# Altium schematic sheet 0012_Processor - PEG, D.SchDoc
size A3
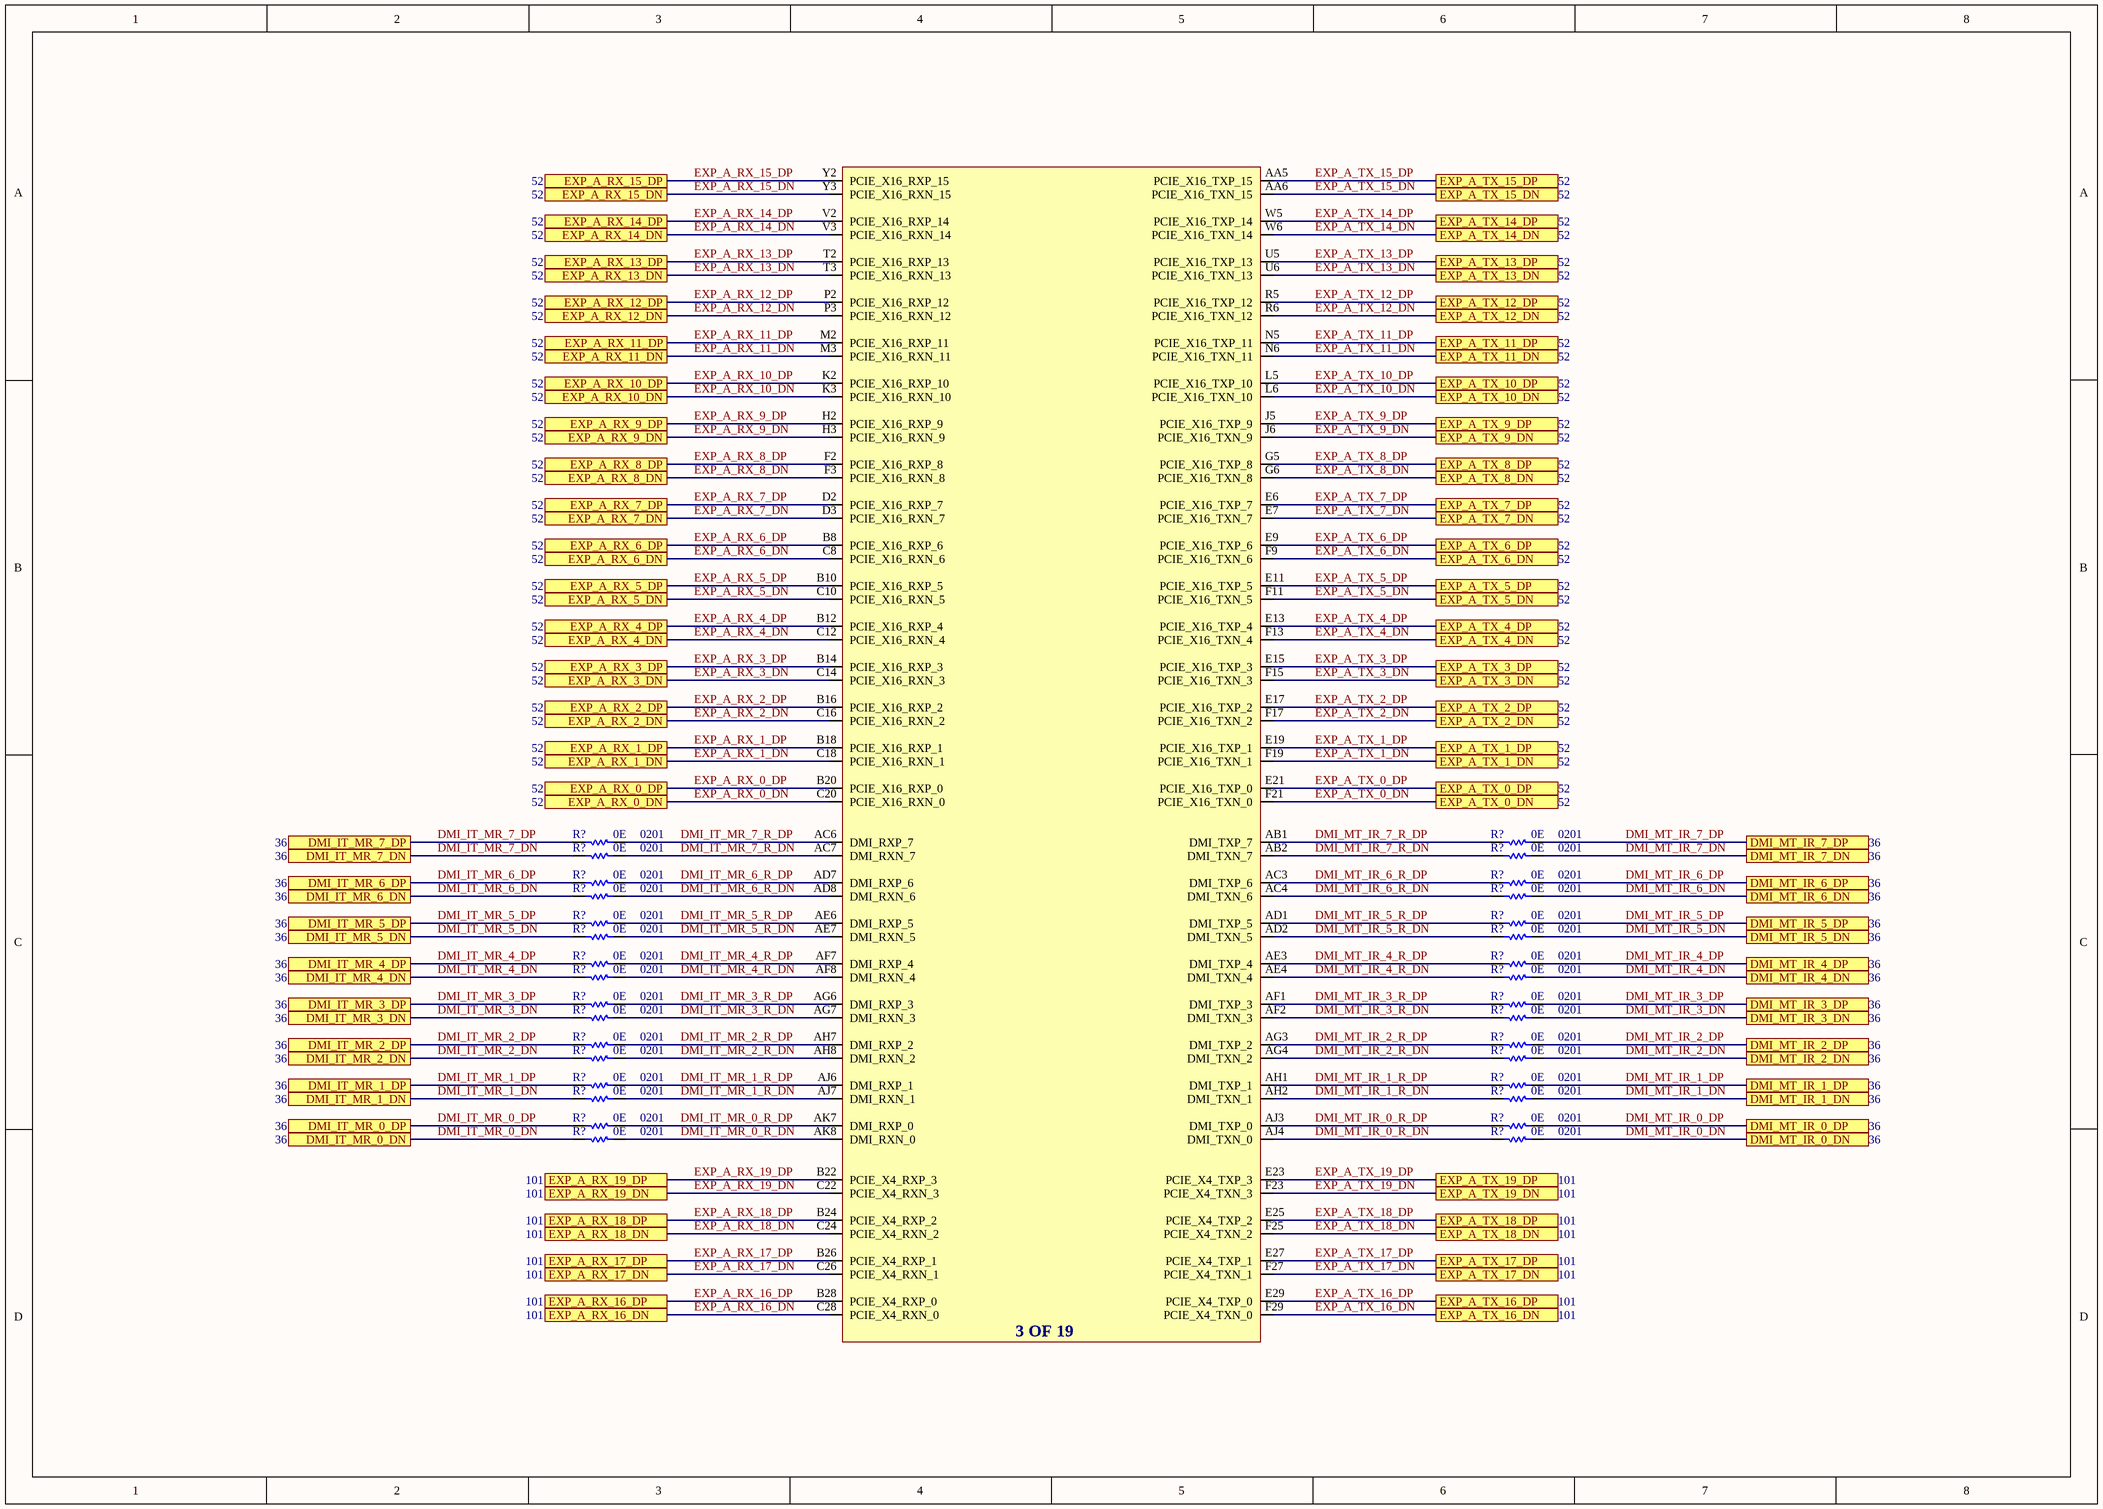
[diagram p0: 0012_Processor - PEG, D.SchDoc]

## Parts
(Parts that share a designator on the sheet are numbered #1, #2 ... from top to bottom, then left to right.)
R?#1  value 0E  Case/Package: 0201  [RESC0201]  (hidden comment: Res)
R?#2  value 0E  Case/Package: 0201  [RESC0201]  (hidden comment: Res)
R?#3  value 0E  Case/Package: 0201  [RESC0201]  (hidden comment: Res)
R?#4  value 0E  Case/Package: 0201  [RESC0201]  (hidden comment: Res)
R?#5  value 0E  Case/Package: 0201  [RESC0201]  (hidden comment: Res)
R?#6  value 0E  Case/Package: 0201  [RESC0201]  (hidden comment: Res)
R?#7  value 0E  Case/Package: 0201  [RESC0201]  (hidden comment: Res)
R?#8  value 0E  Case/Package: 0201  [RESC0201]  (hidden comment: Res)
R?#9  value 0E  Case/Package: 0201  [RESC0201]  (hidden comment: Res)
R?#10  value 0E  Case/Package: 0201  [RESC0201]  (hidden comment: Res)
R?#11  value 0E  Case/Package: 0201  [RESC0201]  (hidden comment: Res)
R?#12  value 0E  Case/Package: 0201  [RESC0201]  (hidden comment: Res)
R?#13  value 0E  Case/Package: 0201  [RESC0201]  (hidden comment: Res)
R?#14  value 0E  Case/Package: 0201  [RESC0201]  (hidden comment: Res)
R?#15  value 0E  Case/Package: 0201  [RESC0201]  (hidden comment: Res)
R?#16  value 0E  Case/Package: 0201  [RESC0201]  (hidden comment: Res)
R?#17  value 0E  Case/Package: 0201  [RESC0201]  (hidden comment: Res)
R?#18  value 0E  Case/Package: 0201  [RESC0201]  (hidden comment: Res)
R?#19  value 0E  Case/Package: 0201  [RESC0201]  (hidden comment: Res)
R?#20  value 0E  Case/Package: 0201  [RESC0201]  (hidden comment: Res)
R?#21  value 0E  Case/Package: 0201  [RESC0201]  (hidden comment: Res)
R?#22  value 0E  Case/Package: 0201  [RESC0201]  (hidden comment: Res)
R?#23  value 0E  Case/Package: 0201  [RESC0201]  (hidden comment: Res)
R?#24  value 0E  Case/Package: 0201  [RESC0201]  (hidden comment: Res)
R?#25  value 0E  Case/Package: 0201  [RESC0201]  (hidden comment: Res)
R?#26  value 0E  Case/Package: 0201  [RESC0201]  (hidden comment: Res)
R?#27  value 0E  Case/Package: 0201  [RESC0201]  (hidden comment: Res)
R?#28  value 0E  Case/Package: 0201  [RESC0201]  (hidden comment: Res)
R?#29  value 0E  Case/Package: 0201  [RESC0201]  (hidden comment: Res)
R?#30  value 0E  Case/Package: 0201  [RESC0201]  (hidden comment: Res)
R?#31  value 0E  Case/Package: 0201  [RESC0201]  (hidden comment: Res)
R?#32  value 0E  Case/Package: 0201  [RESC0201]  (hidden comment: Res)
U1401  C_RPL_HX_EXT  (value not drawn)  (part C of 19)

## Ports
DMI_IT_MR_0_DN, DMI_IT_MR_0_DP, DMI_IT_MR_1_DN, DMI_IT_MR_1_DP, DMI_IT_MR_2_DN, DMI_IT_MR_2_DP, DMI_IT_MR_3_DN, DMI_IT_MR_3_DP, DMI_IT_MR_4_DN, DMI_IT_MR_4_DP, DMI_IT_MR_5_DN, DMI_IT_MR_5_DP, DMI_IT_MR_6_DN, DMI_IT_MR_6_DP, DMI_IT_MR_7_DN, DMI_IT_MR_7_DP, DMI_MT_IR_0_DN, DMI_MT_IR_0_DP, DMI_MT_IR_1_DN, DMI_MT_IR_1_DP, DMI_MT_IR_2_DN, DMI_MT_IR_2_DP, DMI_MT_IR_3_DN, DMI_MT_IR_3_DP, DMI_MT_IR_4_DN, DMI_MT_IR_4_DP, DMI_MT_IR_5_DN, DMI_MT_IR_5_DP, DMI_MT_IR_6_DN, DMI_MT_IR_6_DP, DMI_MT_IR_7_DN, DMI_MT_IR_7_DP, EXP_A_RX_0_DN, EXP_A_RX_0_DP, EXP_A_RX_1_DN, EXP_A_RX_1_DP, EXP_A_RX_2_DN, EXP_A_RX_2_DP, EXP_A_RX_3_DN, EXP_A_RX_3_DP, EXP_A_RX_4_DN, EXP_A_RX_4_DP, EXP_A_RX_5_DN, EXP_A_RX_5_DP, EXP_A_RX_6_DN, EXP_A_RX_6_DP, EXP_A_RX_7_DN, EXP_A_RX_7_DP, EXP_A_RX_8_DN, EXP_A_RX_8_DP, EXP_A_RX_9_DN, EXP_A_RX_9_DP, EXP_A_RX_10_DN, EXP_A_RX_10_DP, EXP_A_RX_11_DN, EXP_A_RX_11_DP, EXP_A_RX_12_DN, EXP_A_RX_12_DP, EXP_A_RX_13_DN, EXP_A_RX_13_DP, EXP_A_RX_14_DN, EXP_A_RX_14_DP, EXP_A_RX_15_DN, EXP_A_RX_15_DP, EXP_A_RX_16_DN, EXP_A_RX_16_DP, EXP_A_RX_17_DN, EXP_A_RX_17_DP, EXP_A_RX_18_DN, EXP_A_RX_18_DP, EXP_A_RX_19_DN, EXP_A_RX_19_DP, EXP_A_TX_0_DN, EXP_A_TX_0_DP, EXP_A_TX_1_DN, EXP_A_TX_1_DP, EXP_A_TX_2_DN, EXP_A_TX_2_DP, EXP_A_TX_3_DN, EXP_A_TX_3_DP, EXP_A_TX_4_DN, EXP_A_TX_4_DP, EXP_A_TX_5_DN, EXP_A_TX_5_DP, EXP_A_TX_6_DN, EXP_A_TX_6_DP, EXP_A_TX_7_DN, EXP_A_TX_7_DP, EXP_A_TX_8_DN, EXP_A_TX_8_DP, EXP_A_TX_9_DN, EXP_A_TX_9_DP, EXP_A_TX_10_DN, EXP_A_TX_10_DP, EXP_A_TX_11_DN, EXP_A_TX_11_DP, EXP_A_TX_12_DN, EXP_A_TX_12_DP, EXP_A_TX_13_DN, EXP_A_TX_13_DP, EXP_A_TX_14_DN, EXP_A_TX_14_DP, EXP_A_TX_15_DN, EXP_A_TX_15_DP, EXP_A_TX_16_DN, EXP_A_TX_16_DP, EXP_A_TX_17_DN, EXP_A_TX_17_DP, EXP_A_TX_18_DN, EXP_A_TX_18_DP, EXP_A_TX_19_DN, EXP_A_TX_19_DP

## Nets
DMI_IT_MR_0_DN: R?#31.1 ; port DMI_IT_MR_0_DN
DMI_IT_MR_0_DP: R?#29.1 ; port DMI_IT_MR_0_DP
DMI_IT_MR_0_R_DN: R?#31.2 U1401.AK8(DMI_RXN_0)
DMI_IT_MR_0_R_DP: R?#29.2 U1401.AK7(DMI_RXP_0)
DMI_IT_MR_1_DN: R?#27.1 ; port DMI_IT_MR_1_DN
DMI_IT_MR_1_DP: R?#25.1 ; port DMI_IT_MR_1_DP
DMI_IT_MR_1_R_DN: R?#27.2 U1401.AJ7(DMI_RXN_1)
DMI_IT_MR_1_R_DP: R?#25.2 U1401.AJ6(DMI_RXP_1)
DMI_IT_MR_2_DN: R?#23.1 ; port DMI_IT_MR_2_DN
DMI_IT_MR_2_DP: R?#21.1 ; port DMI_IT_MR_2_DP
DMI_IT_MR_2_R_DN: R?#23.2 U1401.AH8(DMI_RXN_2)
DMI_IT_MR_2_R_DP: R?#21.2 U1401.AH7(DMI_RXP_2)
DMI_IT_MR_3_DN: R?#19.1 ; port DMI_IT_MR_3_DN
DMI_IT_MR_3_DP: R?#17.1 ; port DMI_IT_MR_3_DP
DMI_IT_MR_3_R_DN: R?#19.2 U1401.AG7(DMI_RXN_3)
DMI_IT_MR_3_R_DP: R?#17.2 U1401.AG6(DMI_RXP_3)
DMI_IT_MR_4_DN: R?#15.1 ; port DMI_IT_MR_4_DN
DMI_IT_MR_4_DP: R?#13.1 ; port DMI_IT_MR_4_DP
DMI_IT_MR_4_R_DN: R?#15.2 U1401.AF8(DMI_RXN_4)
DMI_IT_MR_4_R_DP: R?#13.2 U1401.AF7(DMI_RXP_4)
DMI_IT_MR_5_DN: R?#11.1 ; port DMI_IT_MR_5_DN
DMI_IT_MR_5_DP: R?#9.1 ; port DMI_IT_MR_5_DP
DMI_IT_MR_5_R_DN: R?#11.2 U1401.AE7(DMI_RXN_5)
DMI_IT_MR_5_R_DP: R?#9.2 U1401.AE6(DMI_RXP_5)
DMI_IT_MR_6_DN: R?#7.1 ; port DMI_IT_MR_6_DN
DMI_IT_MR_6_DP: R?#5.1 ; port DMI_IT_MR_6_DP
DMI_IT_MR_6_R_DN: R?#7.2 U1401.AD8(DMI_RXN_6)
DMI_IT_MR_6_R_DP: R?#5.2 U1401.AD7(DMI_RXP_6)
DMI_IT_MR_7_DN: R?#3.1 ; port DMI_IT_MR_7_DN
DMI_IT_MR_7_DP: R?#1.1 ; port DMI_IT_MR_7_DP
DMI_IT_MR_7_R_DN: R?#3.2 U1401.AC7(DMI_RXN_7)
DMI_IT_MR_7_R_DP: R?#1.2 U1401.AC6(DMI_RXP_7)
DMI_MT_IR_0_DN: R?#32.2 ; port DMI_MT_IR_0_DN
DMI_MT_IR_0_DP: R?#30.2 ; port DMI_MT_IR_0_DP
DMI_MT_IR_0_R_DN: R?#32.1 U1401.AJ4(DMI_TXN_0)
DMI_MT_IR_0_R_DP: R?#30.1 U1401.AJ3(DMI_TXP_0)
DMI_MT_IR_1_DN: R?#28.2 ; port DMI_MT_IR_1_DN
DMI_MT_IR_1_DP: R?#26.2 ; port DMI_MT_IR_1_DP
DMI_MT_IR_1_R_DN: R?#28.1 U1401.AH2(DMI_TXN_1)
DMI_MT_IR_1_R_DP: R?#26.1 U1401.AH1(DMI_TXP_1)
DMI_MT_IR_2_DN: R?#24.2 ; port DMI_MT_IR_2_DN
DMI_MT_IR_2_DP: R?#22.2 ; port DMI_MT_IR_2_DP
DMI_MT_IR_2_R_DN: R?#24.1 U1401.AG4(DMI_TXN_2)
DMI_MT_IR_2_R_DP: R?#22.1 U1401.AG3(DMI_TXP_2)
DMI_MT_IR_3_DN: R?#20.2 ; port DMI_MT_IR_3_DN
DMI_MT_IR_3_DP: R?#18.2 ; port DMI_MT_IR_3_DP
DMI_MT_IR_3_R_DN: R?#20.1 U1401.AF2(DMI_TXN_3)
DMI_MT_IR_3_R_DP: R?#18.1 U1401.AF1(DMI_TXP_3)
DMI_MT_IR_4_DN: R?#16.2 ; port DMI_MT_IR_4_DN
DMI_MT_IR_4_DP: R?#14.2 ; port DMI_MT_IR_4_DP
DMI_MT_IR_4_R_DN: R?#16.1 U1401.AE4(DMI_TXN_4)
DMI_MT_IR_4_R_DP: R?#14.1 U1401.AE3(DMI_TXP_4)
DMI_MT_IR_5_DN: R?#12.2 ; port DMI_MT_IR_5_DN
DMI_MT_IR_5_DP: R?#10.2 ; port DMI_MT_IR_5_DP
DMI_MT_IR_5_R_DN: R?#12.1 U1401.AD2(DMI_TXN_5)
DMI_MT_IR_5_R_DP: R?#10.1 U1401.AD1(DMI_TXP_5)
DMI_MT_IR_6_DN: R?#8.2 ; port DMI_MT_IR_6_DN
DMI_MT_IR_6_DP: R?#6.2 ; port DMI_MT_IR_6_DP
DMI_MT_IR_6_R_DN: R?#8.1 U1401.AC4(DMI_TXN_6)
DMI_MT_IR_6_R_DP: R?#6.1 U1401.AC3(DMI_TXP_6)
DMI_MT_IR_7_DN: R?#4.2 ; port DMI_MT_IR_7_DN
DMI_MT_IR_7_DP: R?#2.2 ; port DMI_MT_IR_7_DP
DMI_MT_IR_7_R_DN: R?#4.1 U1401.AB2(DMI_TXN_7)
DMI_MT_IR_7_R_DP: R?#2.1 U1401.AB1(DMI_TXP_7)
EXP_A_RX_0_DN: U1401.C20(PCIE_X16_RXN_0) ; port EXP_A_RX_0_DN
EXP_A_RX_0_DP: U1401.B20(PCIE_X16_RXP_0) ; port EXP_A_RX_0_DP
EXP_A_RX_1_DN: U1401.C18(PCIE_X16_RXN_1) ; port EXP_A_RX_1_DN
EXP_A_RX_1_DP: U1401.B18(PCIE_X16_RXP_1) ; port EXP_A_RX_1_DP
EXP_A_RX_2_DN: U1401.C16(PCIE_X16_RXN_2) ; port EXP_A_RX_2_DN
EXP_A_RX_2_DP: U1401.B16(PCIE_X16_RXP_2) ; port EXP_A_RX_2_DP
EXP_A_RX_3_DN: U1401.C14(PCIE_X16_RXN_3) ; port EXP_A_RX_3_DN
EXP_A_RX_3_DP: U1401.B14(PCIE_X16_RXP_3) ; port EXP_A_RX_3_DP
EXP_A_RX_4_DN: U1401.C12(PCIE_X16_RXN_4) ; port EXP_A_RX_4_DN
EXP_A_RX_4_DP: U1401.B12(PCIE_X16_RXP_4) ; port EXP_A_RX_4_DP
EXP_A_RX_5_DN: U1401.C10(PCIE_X16_RXN_5) ; port EXP_A_RX_5_DN
EXP_A_RX_5_DP: U1401.B10(PCIE_X16_RXP_5) ; port EXP_A_RX_5_DP
EXP_A_RX_6_DN: U1401.C8(PCIE_X16_RXN_6) ; port EXP_A_RX_6_DN
EXP_A_RX_6_DP: U1401.B8(PCIE_X16_RXP_6) ; port EXP_A_RX_6_DP
EXP_A_RX_7_DN: U1401.D3(PCIE_X16_RXN_7) ; port EXP_A_RX_7_DN
EXP_A_RX_7_DP: U1401.D2(PCIE_X16_RXP_7) ; port EXP_A_RX_7_DP
EXP_A_RX_8_DN: U1401.F3(PCIE_X16_RXN_8) ; port EXP_A_RX_8_DN
EXP_A_RX_8_DP: U1401.F2(PCIE_X16_RXP_8) ; port EXP_A_RX_8_DP
EXP_A_RX_9_DN: U1401.H3(PCIE_X16_RXN_9) ; port EXP_A_RX_9_DN
EXP_A_RX_9_DP: U1401.H2(PCIE_X16_RXP_9) ; port EXP_A_RX_9_DP
EXP_A_RX_10_DN: U1401.K3(PCIE_X16_RXN_10) ; port EXP_A_RX_10_DN
EXP_A_RX_10_DP: U1401.K2(PCIE_X16_RXP_10) ; port EXP_A_RX_10_DP
EXP_A_RX_11_DN: U1401.M3(PCIE_X16_RXN_11) ; port EXP_A_RX_11_DN
EXP_A_RX_11_DP: U1401.M2(PCIE_X16_RXP_11) ; port EXP_A_RX_11_DP
EXP_A_RX_12_DN: U1401.P3(PCIE_X16_RXN_12) ; port EXP_A_RX_12_DN
EXP_A_RX_12_DP: U1401.P2(PCIE_X16_RXP_12) ; port EXP_A_RX_12_DP
EXP_A_RX_13_DN: U1401.T3(PCIE_X16_RXN_13) ; port EXP_A_RX_13_DN
EXP_A_RX_13_DP: U1401.T2(PCIE_X16_RXP_13) ; port EXP_A_RX_13_DP
EXP_A_RX_14_DN: U1401.V3(PCIE_X16_RXN_14) ; port EXP_A_RX_14_DN
EXP_A_RX_14_DP: U1401.V2(PCIE_X16_RXP_14) ; port EXP_A_RX_14_DP
EXP_A_RX_15_DN: U1401.Y3(PCIE_X16_RXN_15) ; port EXP_A_RX_15_DN
EXP_A_RX_15_DP: U1401.Y2(PCIE_X16_RXP_15) ; port EXP_A_RX_15_DP
EXP_A_RX_16_DN: U1401.C28(PCIE_X4_RXN_0) ; port EXP_A_RX_16_DN
EXP_A_RX_16_DP: U1401.B28(PCIE_X4_RXP_0) ; port EXP_A_RX_16_DP
EXP_A_RX_17_DN: U1401.C26(PCIE_X4_RXN_1) ; port EXP_A_RX_17_DN
EXP_A_RX_17_DP: U1401.B26(PCIE_X4_RXP_1) ; port EXP_A_RX_17_DP
EXP_A_RX_18_DN: U1401.C24(PCIE_X4_RXN_2) ; port EXP_A_RX_18_DN
EXP_A_RX_18_DP: U1401.B24(PCIE_X4_RXP_2) ; port EXP_A_RX_18_DP
EXP_A_RX_19_DN: U1401.C22(PCIE_X4_RXN_3) ; port EXP_A_RX_19_DN
EXP_A_RX_19_DP: U1401.B22(PCIE_X4_RXP_3) ; port EXP_A_RX_19_DP
EXP_A_TX_0_DN: U1401.F21(PCIE_X16_TXN_0) ; port EXP_A_TX_0_DN
EXP_A_TX_0_DP: U1401.E21(PCIE_X16_TXP_0) ; port EXP_A_TX_0_DP
EXP_A_TX_1_DN: U1401.F19(PCIE_X16_TXN_1) ; port EXP_A_TX_1_DN
EXP_A_TX_1_DP: U1401.E19(PCIE_X16_TXP_1) ; port EXP_A_TX_1_DP
EXP_A_TX_2_DN: U1401.F17(PCIE_X16_TXN_2) ; port EXP_A_TX_2_DN
EXP_A_TX_2_DP: U1401.E17(PCIE_X16_TXP_2) ; port EXP_A_TX_2_DP
EXP_A_TX_3_DN: U1401.F15(PCIE_X16_TXN_3) ; port EXP_A_TX_3_DN
EXP_A_TX_3_DP: U1401.E15(PCIE_X16_TXP_3) ; port EXP_A_TX_3_DP
EXP_A_TX_4_DN: U1401.F13(PCIE_X16_TXN_4) ; port EXP_A_TX_4_DN
EXP_A_TX_4_DP: U1401.E13(PCIE_X16_TXP_4) ; port EXP_A_TX_4_DP
EXP_A_TX_5_DN: U1401.F11(PCIE_X16_TXN_5) ; port EXP_A_TX_5_DN
EXP_A_TX_5_DP: U1401.E11(PCIE_X16_TXP_5) ; port EXP_A_TX_5_DP
EXP_A_TX_6_DN: U1401.F9(PCIE_X16_TXN_6) ; port EXP_A_TX_6_DN
EXP_A_TX_6_DP: U1401.E9(PCIE_X16_TXP_6) ; port EXP_A_TX_6_DP
EXP_A_TX_7_DN: U1401.E7(PCIE_X16_TXN_7) ; port EXP_A_TX_7_DN
EXP_A_TX_7_DP: U1401.E6(PCIE_X16_TXP_7) ; port EXP_A_TX_7_DP
EXP_A_TX_8_DN: U1401.G6(PCIE_X16_TXN_8) ; port EXP_A_TX_8_DN
EXP_A_TX_8_DP: U1401.G5(PCIE_X16_TXP_8) ; port EXP_A_TX_8_DP
EXP_A_TX_9_DN: U1401.J6(PCIE_X16_TXN_9) ; port EXP_A_TX_9_DN
EXP_A_TX_9_DP: U1401.J5(PCIE_X16_TXP_9) ; port EXP_A_TX_9_DP
EXP_A_TX_10_DN: U1401.L6(PCIE_X16_TXN_10) ; port EXP_A_TX_10_DN
EXP_A_TX_10_DP: U1401.L5(PCIE_X16_TXP_10) ; port EXP_A_TX_10_DP
EXP_A_TX_11_DN: U1401.N6(PCIE_X16_TXN_11) ; port EXP_A_TX_11_DN
EXP_A_TX_11_DP: U1401.N5(PCIE_X16_TXP_11) ; port EXP_A_TX_11_DP
EXP_A_TX_12_DN: U1401.R6(PCIE_X16_TXN_12) ; port EXP_A_TX_12_DN
EXP_A_TX_12_DP: U1401.R5(PCIE_X16_TXP_12) ; port EXP_A_TX_12_DP
EXP_A_TX_13_DN: U1401.U6(PCIE_X16_TXN_13) ; port EXP_A_TX_13_DN
EXP_A_TX_13_DP: U1401.U5(PCIE_X16_TXP_13) ; port EXP_A_TX_13_DP
EXP_A_TX_14_DN: U1401.W6(PCIE_X16_TXN_14) ; port EXP_A_TX_14_DN
EXP_A_TX_14_DP: U1401.W5(PCIE_X16_TXP_14) ; port EXP_A_TX_14_DP
EXP_A_TX_15_DN: U1401.AA6(PCIE_X16_TXN_15) ; port EXP_A_TX_15_DN
EXP_A_TX_15_DP: U1401.AA5(PCIE_X16_TXP_15) ; port EXP_A_TX_15_DP
EXP_A_TX_16_DN: U1401.F29(PCIE_X4_TXN_0) ; port EXP_A_TX_16_DN
EXP_A_TX_16_DP: U1401.E29(PCIE_X4_TXP_0) ; port EXP_A_TX_16_DP
EXP_A_TX_17_DN: U1401.F27(PCIE_X4_TXN_1) ; port EXP_A_TX_17_DN
EXP_A_TX_17_DP: U1401.E27(PCIE_X4_TXP_1) ; port EXP_A_TX_17_DP
EXP_A_TX_18_DN: U1401.F25(PCIE_X4_TXN_2) ; port EXP_A_TX_18_DN
EXP_A_TX_18_DP: U1401.E25(PCIE_X4_TXP_2) ; port EXP_A_TX_18_DP
EXP_A_TX_19_DN: U1401.F23(PCIE_X4_TXN_3) ; port EXP_A_TX_19_DN
EXP_A_TX_19_DP: U1401.E23(PCIE_X4_TXP_3) ; port EXP_A_TX_19_DP

## Notes on the sheet
- (in symbol C_RPL_HX_EXT, part C) 3 OF 19

## Library data of the parts
R?#1-R?#32 = Res: Thick Film Resistor -  0ohm, 1%, 0201